# EAGLE design cart (EAGLE 9.5.2)
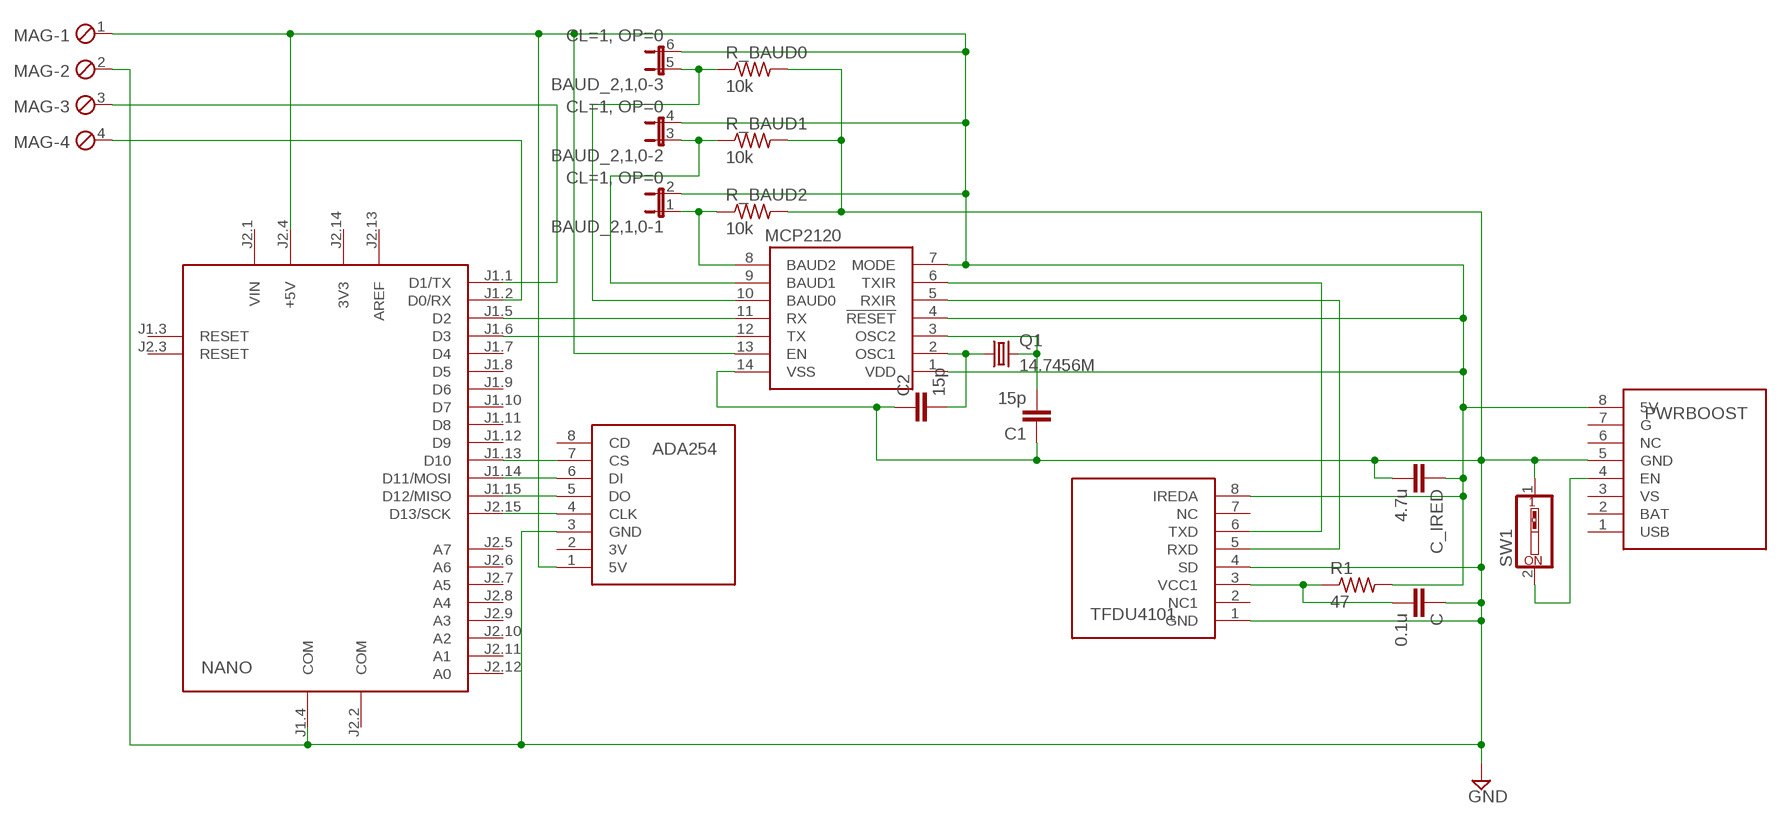
[diagram p0: schematic, sheet 1]

## Parts
ADA254  ADA254_SD_READER  [ADA254_SD_READER]
BAUD_2,1,0  CL=1, OP=0  JP3QE  [JP3Q]
C  0.1u  C-EUC1206  [C1206]
C1  15p  C-EUC1206  [C1206]
C2  15p  C-EUC1206  [C1206]
C_IRED  4.7u  C-EUC1206  [C1206]
MAG  MPT4  [4POL254]
MCP2120  MCP2120_SOIC  [SO14]
NANO  ARDUINO_NANO2  [ARDUINO_NANO2]
PWRBOOST  POWERBOOST_1000C  [POWERBOOST_1000C]
Q1  14.7456M  CRYSTALTC26V  [TC26V]
R1  47  R-US_R1206W  [R1206W]
R_BAUD0  10k  R-US_R1206W  [R1206W]
R_BAUD1  10k  R-US_R1206W  [R1206W]
R_BAUD2  10k  R-US_R1206W  [R1206W]
SW1  SW_DIP-1  [EDG-01]
TFDU4101  TFDU4101_SIDE  [TFDU4101_SIDE]

## Nets
GND: ADA254.3(GND) C1.1 C2.1 C.1 C_IRED.2 MAG.2 MCP2120.14(VSS) NANO.J1.4(COM) PWRBOOST.5(GND) R_BAUD0.2 R_BAUD1.2 R_BAUD2.2 SW1.1 TFDU4101.1(GND) TFDU4101.4(SD)
N$1: MCP2120.11(RX) NANO.J1.5(D2)
N$2: C2.2 MCP2120.2(OSC1) Q1.1
N$3: ADA254.1(5V) BAUD_2,1,0.2 BAUD_2,1,0.4 BAUD_2,1,0.6 C_IRED.1 MAG.1 MCP2120.1(VDD) MCP2120.4(!RESET) MCP2120.7(MODE) MCP2120.13(EN) NANO.J2.4(+5V) PWRBOOST.8(5V) R1.2 TFDU4101.8(IREDA)
N$4: MCP2120.12(TX) NANO.J1.6(D3)
N$5: BAUD_2,1,0.5 MCP2120.10(BAUD0) R_BAUD0.1
N$6: BAUD_2,1,0.3 MCP2120.9(BAUD1) R_BAUD1.1
N$7: BAUD_2,1,0.1 MCP2120.8(BAUD2) R_BAUD2.1
N$8: ADA254.4(CLK) NANO.J2.15(D13/SCK)
N$9: C1.2 MCP2120.3(OSC2) Q1.2
N$10: MCP2120.6(TXIR) TFDU4101.6(TXD)
N$11: MCP2120.5(RXIR) TFDU4101.5(RXD)
N$12: ADA254.5(DO) NANO.J1.15(D12/MISO)
N$13: PWRBOOST.4(EN) SW1.2
N$14: C.2 R1.1 TFDU4101.3(VCC1)
N$15: ADA254.6(DI) NANO.J1.14(D11/MOSI)
N$16: ADA254.7(CS) NANO.J1.13(D10)
N$18: MAG.3 NANO.J1.1(D1/TX)
N$19: MAG.4 NANO.J1.2(D0/RX)
Unconnected: ADA254.2(3V) ADA254.8(CD) NANO.J1.3(RESET) NANO.J1.7(D4) NANO.J1.8(D5) NANO.J1.9(D6) NANO.J1.10(D7) NANO.J1.11(D8) NANO.J1.12(D9) NANO.J2.3(RESET) NANO.J2.5(A7) NANO.J2.6(A6) NANO.J2.7(A5) NANO.J2.8(A4) NANO.J2.9(A3) NANO.J2.10(A2) NANO.J2.11(A1) NANO.J2.12(A0) PWRBOOST.1(USB) PWRBOOST.2(BAT) PWRBOOST.3(VS) PWRBOOST.6(NC) PWRBOOST.7(G) TFDU4101.2(NC1) TFDU4101.7(NC)

## Power pins joined to a net without a drawn wire
3V3: NANO.J2.14(3V3)
AREF: NANO.J2.13(AREF)
COM: NANO.J2.2(COM)
VIN: NANO.J2.1(VIN)

## Library data of the parts
ADA254 = arduino:ADA254_SD_READER
BAUD_2,1,0 = jumper:JP3QE: JUMPER
C C1 C2 C_IRED = rcl:C-EU: CAPACITOR, European symbol; SPICEPREFIX: C
MAG = con-phoenix-254_modified:MPT4: PHOENIX CONNECTOR; OC_FARNELL: unknown; OC_NEWARK: unknown
MCP2120 = IrDA_transceiver:MCP2120_SOIC
NANO = arduino:ARDUINO_NANO2: Arduino Nano2 Auto generated by modulcreator.ulp \;; ANZAHL: 2; MODUL: TRUE; STECKX0: -76200; STECKX1: 76200; STECKY0: 177800; STECKY1: 177800
PWRBOOST = arduino:POWERBOOST_1000C
Q1 = crystal:CRYSTAL: CRYSTAL; OC_FARNELL: unknown; OC_NEWARK: unknown
R1 R_BAUD0 R_BAUD1 R_BAUD2 = rcl:R-US_: RESISTOR, American symbol; SPICEPREFIX: R
SW1 = special_modified:SW_DIP-1: DIP SWITCH
TFDU4101 = IrDA_transceiver:TFDU4101_SIDE

## Board
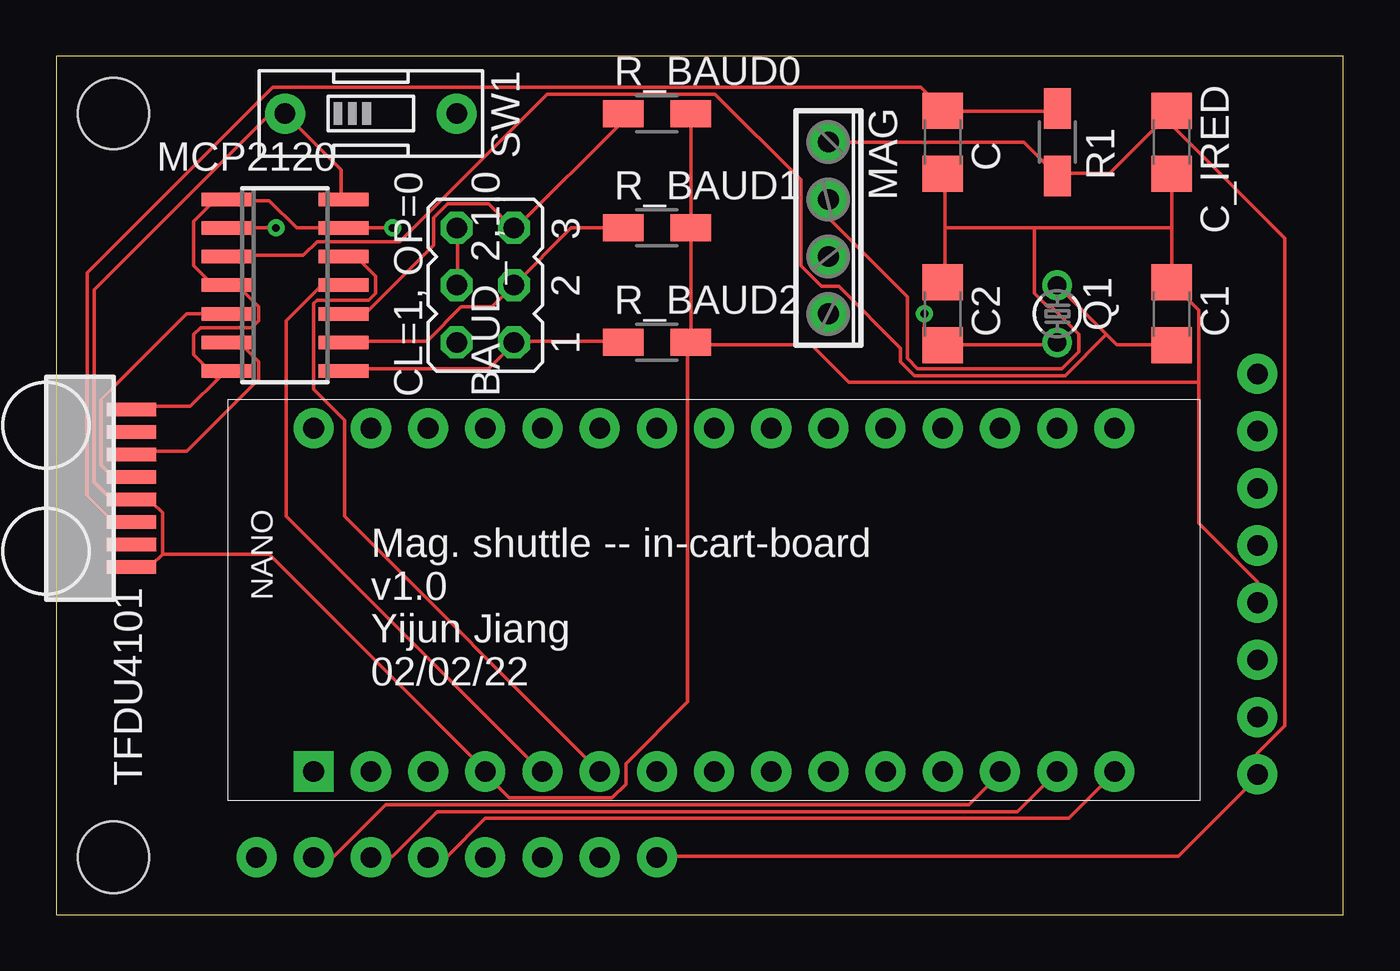
[diagram p1: board, top side]
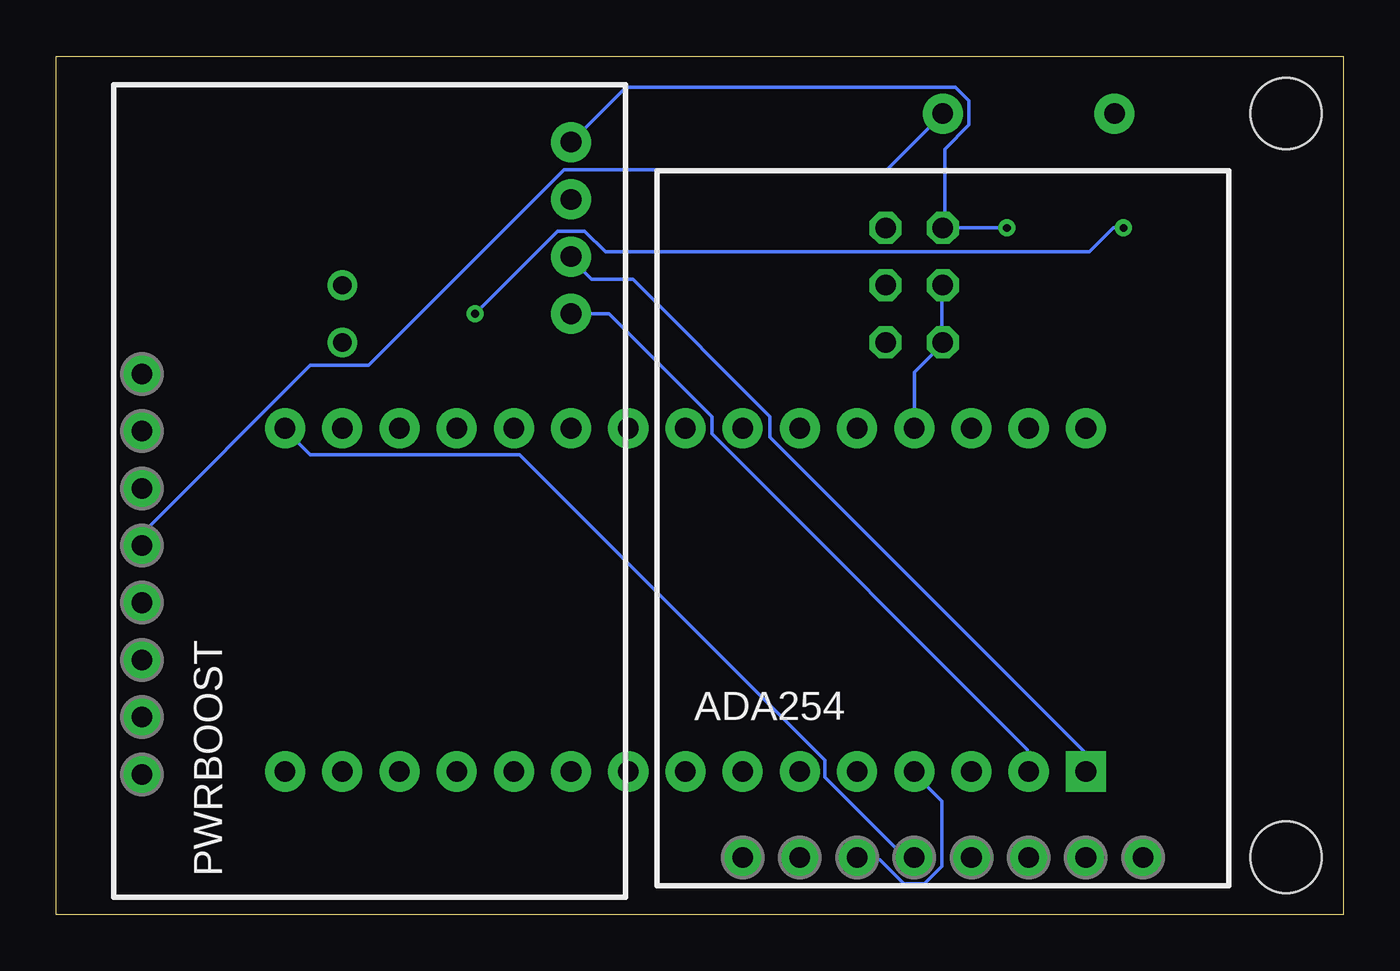
[diagram p2: board, bottom side, seen from below]

Size 57.15 x 38.1 mm. Coordinates in mm from the lower left corner, seen from the top.
Outline: 0,0 57.15,0 57.15,38.1 0,38.1 0,0
Copper layers (1*16): Top 0.035mm / dielectric 1.5mm / Bottom 0.035mm
Design rules "default": minimum track width 6mil, minimum drill 0.35mm, track to track 6mil, track to pad 6mil, pad to pad 6mil, via to via 6mil, smd to smd 6mil, copper to edge 40mil, drill to drill 6mil, minimum pad ring 10mil, minimum via ring 8mil, stop-mask expansion 4mil, vias tented up to drill 0mil, thermal gap 10mil
Holes 3.17 mm at 2.54,35.56 2.54,2.54

### Footprints (pad centres in the part's own frame; a part is rotated, then mirrored left to right if it is on the bottom)
ADA254_SD_READER = drill 0.914 pad 1.778: 1 3.81,1.27; 2 6.35,1.27; 3 8.89,1.27; 4 11.43,1.27; 5 13.97,1.27; 6 16.51,1.27; 7 19.05,1.27; 8 21.59,1.27
JP3Q = drill 0.914 octagon: 1 -2.54,-1.27; 2 -2.54,1.27; 3 0,-1.27; 4 0,1.27; 5 2.54,-1.27; 6 2.54,1.27
C1206 = smd 1.6 x 1.8: 1 -1.4,0; 2 1.4,0
4POL254 = drill 0.914 pad 1.778: 1 -3.81,0; 2 -1.27,0; 3 1.27,0; 4 3.81,0
SO14 = smd 0.6 x 2.2: 1 -3.81,-2.6; 2 -2.54,-2.6; 3 -1.27,-2.6; 4 0,-2.6; 5 1.27,-2.6; 6 2.54,-2.6; 7 3.81,-2.6; 8 3.81,2.6; 9 2.54,2.6; 10 1.27,2.6; 11 0,2.6; 12 -1.27,2.6; 13 -2.54,2.6; 14 -3.81,2.6
ARDUINO_NANO2 = drill 0.914 pad 1.778 square: J1.1 -7.62,17.78 | drill 0.914 pad 1.778: J1.2 -7.62,15.24; J1.3 -7.62,12.7; J1.4 -7.62,10.16; J1.5 -7.62,7.62; J1.6 -7.62,5.08; J1.7 -7.62,2.54; J1.8 -7.62,0; J1.9 -7.62,-2.54; J1.10 -7.62,-5.08; J1.11 -7.62,-7.62; J1.12 -7.62,-10.16; J1.13 -7.62,-12.7; J1.14 -7.62,-15.24; J1.15 -7.62,-17.78; J2.1 7.62,17.78; J2.2 7.62,15.24; J2.3 7.62,12.7; J2.4 7.62,10.16; J2.5 7.62,7.62; J2.6 7.62,5.08; J2.7 7.62,2.54; J2.8 7.62,0; J2.9 7.62,-2.54; J2.10 7.62,-5.08; J2.11 7.62,-7.62; J2.12 7.62,-10.16; J2.13 7.62,-12.7; J2.14 7.62,-15.24; J2.15 7.62,-17.78
POWERBOOST_1000C = drill 0.914 pad 1.778: 1 12.827,1.27; 2 15.367,1.27; 3 17.907,1.27; 4 20.447,1.27; 5 22.987,1.27; 6 25.527,1.27; 7 28.067,1.27; 8 30.607,1.27
TC26V = drill 0.813: 1 -1.27,0; 2 1.27,0
R1206W = smd 1.8 x 1.2: 1 -1.499,0; 2 1.499,0
EDG-01 = drill 0.914 pad 1.778: 1 0,-3.81; 2 0,3.81
TFDU4101_SIDE = smd 0.6 x 2.2: 1 1.453,-0.79; 2 2.453,-0.79; 3 3.453,-0.79; 4 4.453,-0.79; 5 5.453,-0.79; 6 6.453,-0.79; 7 7.453,-0.79; 8 8.453,-0.79

### Placement (x,y rotation side)
ADA254  30.48,1.27 0 bottom
BAUD_2,1,0  19.05,27.94 90 top
C  39.37,34.29 90 top
C1  49.53,26.67 270 top
C2  39.37,26.67 270 top
C_IRED  49.53,34.29 270 top
MAG  34.29,30.48 270 top
MCP2120  10.16,27.94 270 top
NANO  29.21,13.97 90 top
PWRBOOST  54.61,36.83 270 bottom
Q1  44.45,26.67 90 top
R1  44.45,34.29 270 top
R_BAUD0  26.67,35.56 0 top
R_BAUD1  26.67,30.48 0 top
R_BAUD2  26.67,25.4 0 top
SW1  13.97,35.56 270 top
TFDU4101  2.54,13.97 90 top

### Tracks (layer width: path | path; a pad name or v marks a point on that pad's centre or on a via)
GND
  Top 0.152: 28.19,30.48 28.19,25.45 R_BAUD2.2 | 28.19,30.48 28.19,35.51 R_BAUD0.2 | 28.19,30.48 R_BAUD1.2 | 39.47,30.48 39.47,32.77 C.1 | 39.47,30.48 39.47,28.19 C2.1 | C_IRED.2 49.53,30.48 | 49.53,30.48 C1.1 49.53,28.04 50.75,26.82 50.75,23.62 | 49.53,30.48 43.43,30.48 | 43.43,30.48 39.47,30.48 | MAG.2 34.29,30.94 37.8,27.43 37.8,24.69 38.25,24.23 44.65,24.23 45.41,24.99 45.41,25.76 44.2,26.98 44.04,26.98 43.43,27.58 43.43,30.48 | PWRBOOST.5 53.34,14.78 50.75,17.37 50.75,23.62 | 50.75,23.62 35.2,23.62 33.53,25.3 28.19,25.3 R_BAUD2.2 | MCP2120.14 12.65,31.85 12.65,33.07 SW1.1 10.06,35.51 9.45,35.51 1.68,27.74 1.68,19.2 2.44,18.44 3.2,18.44 TFDU4101.4 3.35,18.29 4.27,18.29 4.72,17.83 4.72,16 | 4.72,16 4.27,15.54 3.35,15.54 TFDU4101.1 | 4.72,16 9.45,16 19.05,6.4 NANO.J1.4 19.05,6.25 20.12,5.18 24.69,5.18 25.3,5.79 25.3,6.71 28.04,9.45 28.04,25.3 R_BAUD2.2
  Bottom 0.152: ADA254.3 21.49,2.44 20.57,2.44 19.51,1.37 18.59,1.37 17.83,2.13 17.83,5.03 19.05,6.25 NANO.J1.4
N$1
  Top 0.152: MCP2120.11 12.65,27.89 11.73,27.89 10.21,26.36 10.21,17.68 21.49,6.4 NANO.J1.5
N$2  (via drill 0.35)
  Top 0.152: Q1.1 44.35,25.3 39.47,25.3 C2.2 39.32,25.3 38.56,26.06 v38.56,26.67 | v9.75,30.48 MCP2120.2
  Bottom 0.152: v9.75,30.48 10.21,30.48 11.28,29.41 32.77,29.41 33.68,30.33 34.9,30.33 v38.56,26.67
N$3  (via drill 0.35)
  Top 0.152: ADA254.1 26.67,2.59 49.84,2.59 53.34,6.1 PWRBOOST.8 53.34,7.16 54.56,8.38 54.56,30.02 49.23,35.36 | 7.16,23.77 7.47,24.08 MCP2120.7 | 7.16,23.77 5.94,22.55 3.35,22.55 TFDU4101.8 | 7.16,23.77 6.1,24.84 6.1,25.76 6.4,26.06 8.69,26.06 8.99,26.36 8.99,26.98 8.08,27.89 7.62,27.89 MCP2120.4 7.47,28.04 6.86,28.04 6.1,28.8 6.1,30.79 7.01,31.7 7.47,31.7 MCP2120.1 7.62,31.7 9.45,31.7 10.67,30.48 MCP2120.13 v14.94,30.48 | BAUD_2,1,0.6 17.83,30.48 17.83,28.04 BAUD_2,1,0.4 | 49.23,35.36 49.53,35.66 C_IRED.1 49.23,35.36 | 49.23,35.36 46.79,32.92 44.5,32.92 R1.2 44.35,32.92 42.98,34.29 MAG.1
  Bottom 0.152: BAUD_2,1,0.4 17.83,27.89 17.83,25.45 BAUD_2,1,0.2 17.83,25.3 19.05,24.08 NANO.J2.4 | 17.68,30.48 17.68,33.98 16.61,35.05 16.61,36.12 17.22,36.73 31.85,36.73 MAG.1 | 17.68,30.48 v14.94,30.48 | 17.68,30.48 BAUD_2,1,0.6
N$4
  Top 0.152: NANO.J1.6 12.8,17.68 12.8,21.95 11.43,23.32 11.43,27.13 11.58,27.28 13.87,27.28 14.17,27.58 14.17,28.35 13.41,29.11 12.8,29.11 MCP2120.12
N$5
  Top 0.152: R_BAUD0.1 25.15,35.51 25.15,35.2 20.42,30.48 BAUD_2,1,0.5 20.27,30.48 19.2,31.55 17.37,31.55 16.76,30.94 16.76,29.72 13.72,26.67 MCP2120.10
N$6
  Top 0.152: R_BAUD1.1 22.86,30.48 BAUD_2,1,0.3 19.36,26.98 17.98,26.98 16.46,25.45 12.8,25.45 MCP2120.9
N$7
  Top 0.152: R_BAUD2.1 25.15,25.45 20.42,25.45 BAUD_2,1,0.1 20.27,25.3 19.2,24.23 12.8,24.23 MCP2120.8
N$8
  Bottom 0.152: ADA254.4 19.05,2.59 19.51,2.59 23.01,6.1 23.01,6.86 36.58,20.42 45.87,20.42 46.94,21.49 NANO.J2.15
N$9
  Top 0.152: Q1.2 46.63,25.76 | 46.63,25.76 47.09,25.3 49.53,25.3 C1.2 | 46.63,25.76 44.81,23.93 38.1,23.93 37.49,24.54 37.49,25.15 34.75,27.89 33.98,27.89 33.07,28.8 33.07,32.61 29.26,36.42 21.79,36.42 15.24,29.87 11.58,29.87 10.97,29.26 7.62,29.26 MCP2120.3
N$10
  Top 0.152: TFDU4101.6 3.35,20.57 5.79,20.57 8.99,23.77 8.99,24.54 8.23,25.3 7.62,25.3 MCP2120.6
N$11
  Top 0.152: MCP2120.5 5.79,26.67 1.98,22.86 1.98,19.96 2.44,19.51 3.2,19.51 TFDU4101.5
N$12
  Top 0.152: ADA254.5 16.61,2.59 17.37,2.59 19.05,4.27 44.96,4.27 46.94,6.25 NANO.J1.15
N$13
  Bottom 0.152: PWRBOOST.4 53.34,16.92 45.87,24.38 43.28,24.38 34.59,33.07 20.27,33.07 SW1.2
N$14
  Top 0.152: R1.1 44.35,35.66 39.47,35.66 C.2 39.32,35.81 38.41,36.73 9.6,36.73 1.37,28.5 1.37,18.59 2.44,17.53 3.2,17.53 TFDU4101.3
N$15
  Top 0.152: NANO.J1.14 42.67,4.57 16.92,4.57 14.94,2.59 14.02,2.59 ADA254.6
N$16
  Top 0.152: ADA254.7 11.43,2.59 12.34,2.59 14.63,4.88 40.54,4.88 41.91,6.25 NANO.J1.13
N$18
  Bottom 0.152: NANO.J1.1 11.43,7.16 25.45,21.18 25.45,22.1 31.55,28.19 33.38,28.19 34.29,29.11 MAG.3
N$19
  Bottom 0.152: MAG.4 32.61,26.67 28.04,22.1 28.04,21.34 14.02,7.32 14.02,6.4 NANO.J1.2

### Text on the board
tNames: Mag. shuttle -- in-cart-board / v1.0 / Yijun Jiang / 02/02/22
tValues: Space left for card guide